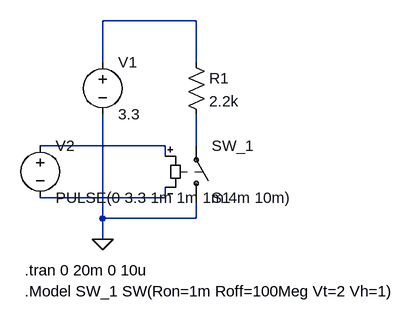
[diagram p0: schematic Draft8.asc]
Draft8.asc, the LTspice schematic file:
Version 4
SHEET 1 880 680
WIRE 176 -80 32 -80
WIRE 32 -16 32 -80
WIRE 176 -16 176 -80
WIRE 128 112 -64 112
WIRE 176 112 176 64
WIRE 128 128 128 112
WIRE 128 192 128 176
WIRE 128 192 -64 192
WIRE 32 224 32 64
WIRE 176 224 176 192
WIRE 176 224 32 224
WIRE 32 256 32 224
FLAG 32 256 0
SYMBOL res 160 -32 R0
SYMATTR InstName R1
SYMATTR Value 2.2k
SYMBOL voltage 32 -32 R0
WINDOW 123 0 0 Left 0
WINDOW 39 0 0 Left 0
SYMATTR InstName V1
SYMATTR Value 3.3
SYMBOL sw 176 208 M180
SYMATTR InstName S1
SYMATTR Value SW_1
SYMBOL voltage -64 96 R0
WINDOW 123 0 0 Left 0
WINDOW 39 0 0 Left 0
SYMATTR InstName V2
SYMATTR Value PULSE(0 3.3 1m 1m 1m 4m 10m)
TEXT -88 336 Left 2 !.Model SW_1 SW(Ron=1m Roff=100Meg Vt=2 Vh=1)
TEXT -88 304 Left 2 !.tran 0 20m 0 10u

The netlist it stands for:
* Draft8.asc
R1 N001 N003 2.2k
V1 N001 0 3.3
S1 0 N003 N002 N004 SW_1
V2 N002 N004 PULSE(0 3.3 1m 1m 1m 4m 10m)
.Model SW_1 SW(Ron=1m Roff=100Meg Vt=2 Vh=1)
.tran 0 20m 0 10u
.backanno
.end